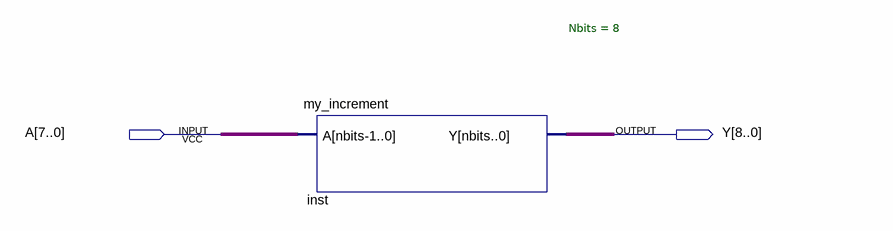
[diagram p0: schematic sheet]
// Quartus schematic behavioural.bdf as structural Verilog: 1 symbols, 2 pins
module behavioural (
  input  [7:0] A,
  output [8:0] Y
);

  my_increment #(.Nbits(8)) inst (.A(A), .Y(Y));
endmodule
